# EAGLE design duck_sensor (EAGLE 8.1.1)
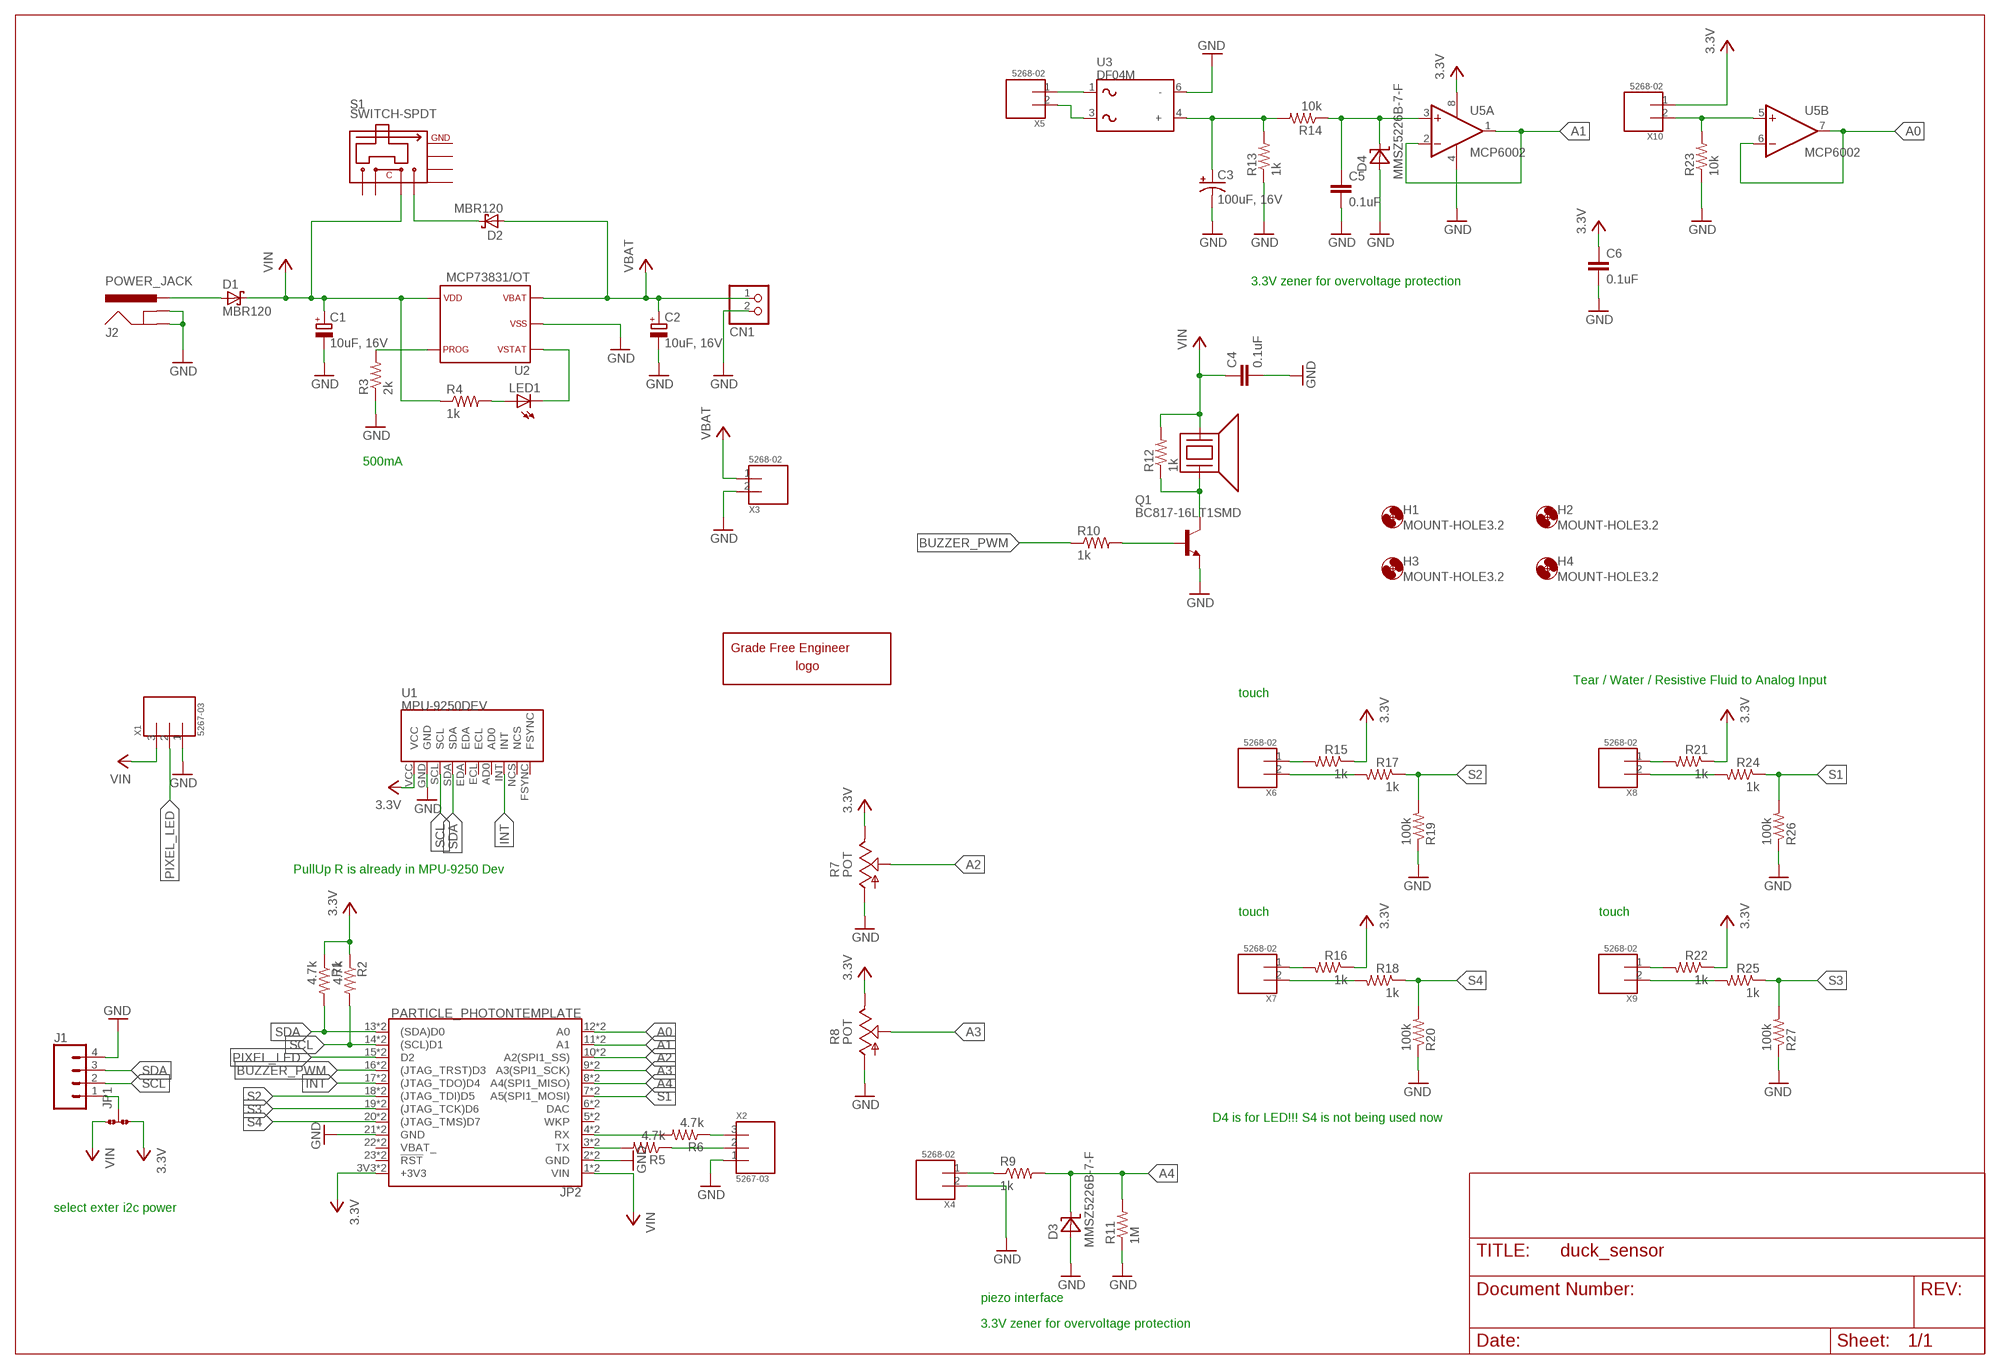
[diagram p0: schematic, sheet 1]

## Parts
C1  10uF, 16V  C-TANTAL-A  [C1206(3216)-A]
C2  10uF, 16V  C-TANTAL-A  [C1206(3216)-A]
C3  100uF, 16V  CPOL-USE2,5-6E  [E2,5-6E]
C4  0.1uF  C0603(1608)_HAND  [C0603(1608)_HANDSOLDER]
C5  0.1uF  C0603(1608)_HAND  [C0603(1608)_HANDSOLDER]
C6  0.1uF  C0603(1608)_HAND  [C0603(1608)_HANDSOLDER]
CN1  JST_2PIN-SMT-RA  [JST-PH-2-SMT-RA]
D1  MBR120  [SOD-123]
D2  MBR120  [SOD-123]
D3  MMSZ5226B-7-F  [SOD-123]
D4  MMSZ5226B-7-F  [SOD-123]
H1  MOUNT-HOLE3.2  [3,2]
H2  MOUNT-HOLE3.2  [3,2]
H3  MOUNT-HOLE3.2  [3,2]
H4  MOUNT-HOLE3.2  [3,2]
J1  CONN_04  [1X04]
J2  POWER_JACK  [POWER_JACK_PTH]
JP1  JP2  [JP2SMD0603]
JP2  PARTICLE_PHOTONTEMPLATE  [PARTICLE_PHOTON_TEMPLATE]
LED1  LED0603  [LED-0603]
LOGO1  GRADEFREELOGO-20  [GRADEFREELOGO-20]
Q1  BC817-16LT1SMD  [SOT23-BEC]
R1  4.7k  R0603(1608)_HAND  [R0603(1608)_HANDSOLDER]
R2  4.7k  R0603(1608)_HAND  [R0603(1608)_HANDSOLDER]
R3  2k  R0603(1608)_HAND  [R0603(1608)_HANDSOLDER]
R4  1k  R0603(1608)_HAND  [R0603(1608)_HANDSOLDER]
R5  4.7k  R0603(1608)_HAND  [R0603(1608)_HANDSOLDER]
R6  4.7k  R0603(1608)_HAND  [R0603(1608)_HANDSOLDER]
R7  POT  [RK09L]
R8  POT  [RK09L]
R9  1k  R0603(1608)_HAND  [R0603(1608)_HANDSOLDER]
R10  1k  R0603(1608)_HAND  [R0603(1608)_HANDSOLDER]
R11  1M  R0603(1608)_HAND  [R0603(1608)_HANDSOLDER]
R12  1k  R0603(1608)_HAND  [R0603(1608)_HANDSOLDER]
R13  1k  R0603(1608)_HAND  [R0603(1608)_HANDSOLDER]
R14  10k  R0603(1608)_HAND  [R0603(1608)_HANDSOLDER]
R15  1k  R0603(1608)_HAND  [R0603(1608)_HANDSOLDER]
R16  1k  R0603(1608)_HAND  [R0603(1608)_HANDSOLDER]
R17  1k  R0603(1608)_HAND  [R0603(1608)_HANDSOLDER]
R18  1k  R0603(1608)_HAND  [R0603(1608)_HANDSOLDER]
R19  100k  R0603(1608)_HAND  [R0603(1608)_HANDSOLDER]
R20  100k  R0603(1608)_HAND  [R0603(1608)_HANDSOLDER]
R21  1k  R0603(1608)_HAND  [R0603(1608)_HANDSOLDER]
R22  1k  R0603(1608)_HAND  [R0603(1608)_HANDSOLDER]
R23  10k  R0603(1608)_HAND  [R0603(1608)_HANDSOLDER]
R24  1k  R0603(1608)_HAND  [R0603(1608)_HANDSOLDER]
R25  1k  R0603(1608)_HAND  [R0603(1608)_HANDSOLDER]
R26  100k  R0603(1608)_HAND  [R0603(1608)_HANDSOLDER]
R27  100k  R0603(1608)_HAND  [R0603(1608)_HANDSOLDER]
S1  SWITCH-SPDT  [SSSS810201]
U1  MPU-9250DEV  [MPU-9250]
U2  MCP73831/OT  [SOT23-5L]
U3  DF04M  [DIL06]
U4  BUZZER  [PS1240]
U5  MCP6002  [DIL08]
X1  5267-03  [5267-03]
X2  5267-03  [5267-03]
X3  5268-02  [5628-02]
X4  5268-02  [5628-02]
X5  5268-02  [5628-02]
X6  5268-02  [5628-02]
X7  5268-02  [5628-02]
X8  5268-02  [5628-02]
X9  5268-02  [5628-02]
X10  5268-02  [5628-02]

## Nets
3.3V: C6.1 JP1.3 JP2.3V3(+3V3) JP2.24(+3V3) R1.1 R2.1 R7.1(E) R8.1(E) R15.1 R16.1 R21.1 R22.1 U1.VCC U5.8(V+) X10.1
A0: JP2.12(A0) JP2.A0 U5.6(B:-IN) U5.7(B:OUT)
A1: JP2.11(A1) JP2.A1 U5.1(A:OUT) U5.2(A:-IN)
A2: JP2.10(A2(SPI1_SS)) JP2.A2(A2(SPI1_SS)) R7.2(S)
A3: JP2.9(A3(SPI1_SCK)) JP2.A3(A3(SPI1_SCK)) R8.2(S)
A4: D3.C JP2.8(A4(SPI1_MISO)) JP2.A4(A4(SPI1_MISO)) R9.2 R11.2
BUZZER_PWM: JP2.16((JTAG_TRST)D3) JP2.D3((JTAG_TRST)D3) R10.1
GND: C1.2(-) C2.2(-) C3.- C4.2 C5.2 C6.2 CN1.2 D3.A D4.A J1.4 J2.GND J2.GNDBREAK JP2.2(GND) JP2.21(GND) JP2.GND@0(GND) JP2.GND@2(GND) Q1.E R3.1 R7.3(A) R8.3(A) R11.1 R13.1 R19.1 R20.1 R23.1 R26.1 R27.1 U1.GND U2.2(VSS) U3.6(-) U5.4(V-) X1.1 X2.1 X3.2 X4.2
INT: JP2.17((JTAG_TDO)D4) JP2.D4((JTAG_TDO)D4) U1.INT
N$1: D2.C S1.1
N$2: R15.2 X6.1
N$3: LED1.A R4.2
N$4: LED1.C U2.1(STAT)
N$5: R3.2 U2.5(PROG)
N$6: D1.A J2.PWR
N$7: R9.1 X4.1
N$8: R17.2 X6.2
N$10: R16.2 X7.1
N$11: R18.2 X7.2
N$12: JP2.3(TX) JP2.TX R5.2
N$13: JP2.4(RX) JP2.RX R6.2
N$14: R6.1 X2.3
N$15: R5.1 X2.2
N$17: Q1.B R10.2
N$18: Q1.C R12.1 U4.2
N$20: J1.1 JP1.2
N$23: C5.1 D4.C R14.1 U5.3(A:+IN)
N$24: R23.2 U5.5(B:+IN) X10.2
N$25: R21.2 X8.1
N$26: R24.2 X8.2
N$27: R22.2 X9.1
N$28: C3.+ R13.2 R14.2 U3.4(+)
N$29: U3.1 X5.1
N$30: U3.3 X5.2
N$31: R25.2 X9.2
PIXEL_LED: JP2.15(D2) JP2.D2 X1.2
S1: JP2.7(A5(SPI1_MOSI)) JP2.A5(A5(SPI1_MOSI)) R24.1 R26.2
S2: JP2.18((JTAG_TDI)D5) JP2.D5((JTAG_TDI)D5) R17.1 R19.2
S3: JP2.19((JTAG_TCK)D6) JP2.D6((JTAG_TCK)D6) R25.1 R27.2
S4: JP2.20((JTAG_TMS)D7) JP2.D7((JTAG_TMS)D7) R18.1 R20.2
SCL: J1.2 JP2.14((SCL)D1) JP2.D1((SCL)D1) R2.2 U1.SCL
SDA: J1.3 JP2.13((SDA)D0) JP2.D0((SDA)D0) R1.2 U1.SDA
VBAT: C2.1(+) CN1.1 D2.A U2.3(VBAT) X3.1
VIN: C1.1(+) C4.1 D1.C JP1.1 JP2.1(VIN) JP2.VIN R4.1 R12.2 S1.2 U2.4(VDD) U4.1 X1.3
Unconnected: JP2.5(WKP) JP2.6(DAC) JP2.23(!RST!) JP2.DAC JP2.RST(!RST!) JP2.WKP S1.3 S1.4 S1.G1(GNDTERMINAL) S1.G2(GNDTERMINAL1) S1.G3(GNDTERMINAL2) S1.G4(GNDTERMINAL3) U1.AD0 U1.ECL U1.EDA U1.FSYNC U1.NCS

## Notes on the sheet
- 3.3V zener for overvoltage protection
- 500mA
- Tear / Water / Resistive Fluid to Analog Input
- touch
- PullUp R is already in MPU-9250 Dev
- touch | touch
- D4 is for LED!!! S4 is not being used now
- select exter i2c power
- piezo interface
- 3.3V zener for overvoltage protection

## Power pins joined to a net without a drawn wire
VBAT_: JP2.22(VBAT_) JP2.VBAT_

## Library data of the parts
C1 C2 = berry:C-TANTAL-A: TAJA105M020RNJ Tantal Capacitor Manufacturer: AVX 1206(3126) Ref: www.avx.com/docs/techinfo/tantappl.pdf
C3 = adafruit:CPOL-US: POLARIZED CAPACITOR, American symbol
C4-C6 = GFE:C
CN1 = GFE:JST_2PIN: JST 2-Pin Connectors of various flavors SMT-RA (S2B-PH-SM4) 4UConnector #17311 SMT (B2B-PH-SM4) THM-RA (S2B-PH) THM (B2B-PH)
D1 D2 = GFE:MBR120
D3 D4 = GFE:MMSZ5226B-7-F
H1-H4 = holes:MOUNT-HOLE: MOUNTING HOLE with drill center marker
J1 = SparkFun-Connectors:CONN_04: Multi connection point. Often used as Generic Header-pin footprint for 0.1 inch spaced/style header connections On any of the 0.1 inch spaced packages, you can populate with these: Break Away Headers - Straight <https://www.sparkfun.com/products/116> (PRT-00116) Break Away Male Headers - Right Angle <https://www.sparkfun.com/products/553> (PRT-00553) Female Headers <https://www.sparkfun.com/products/115> (PRT-00115) Break Away Headers - Machine Pin <https://www.sparkfun.com/products/117> (PRT-00117) Break Away Female Headers - Swiss Machine Pin <https://www.sparkfun.com/products/743> (PRT-00743) For SCREWTERMINALS and SPRING TERMINALS visit here: Screw Terimnals on SparkFun.com <https://www.sparkfun.com/search/results?term=Screw+Terminals> (5mm/3.5mm/2.54mm spacing) This device is also useful as a general connection point to wire up your design to another part of your project. Our various solder wires solder well into these plated through hole pads. Hook-Up Wire - Assortment (Stranded, 22 AWG) <https://www.sparkfun.com/products/11375> (PRT-11375) Hook-Up Wire - Assortment (Solid Core, 22 AWG) <https://www.sparkfun.com/products/11367> (PRT-11367) View the entire wire category on our website here <https://www.sparkfun.com/categories/141> Special notes: Molex polarized connector foot print use with SKU : PRT-08231 with associated crimp pins and housings. 1MM SMD Version SKU: PRT-10208; PROD_ID: CONN-09696
J2 = GFE:POWER_JACK: Power Jack Connector This is the standard 5.5mm barrel jack for power. The PTH is the most common, proven, reliable, footprint. The Slot footprint only works if the mill layer is transmitted to the PCB fab house so be warned. Here are the connectors we sell at SparkFun: DC Barrel Power Jack/Connector <https://www.sparkfun.com/products/119> (PRT-00119) DC Barrel Power Jack/Connector (SMD) <https://www.sparkfun.com/products/12748> (PRT-12748) DC Barrel Jack Adapter - Breadboard Compatible <https://www.sparkfun.com/products/10811> (PRT-10811) It is used on this SparkFun product (and many, many others): SparkFun RedBoard - Programmed with Arduino <https://www.sparkfun.com/products/12757> (DEV-12757) Also, if you need a mating power supply or connector, please check these out: Wall Adapter Power Supply - 9VDC 650mA <https://www.sparkfun.com/products/298> (TOL-00298) DC Barrel Jack Adapter - Male <https://www.sparkfun.com/products/10287> (PRT-10287); PROD_ID: CONN-08197
JP1 = OSSI:JP2
JP2 = GFE:PARTICLE_PHOTON: Particle Photon Footprint of the Particle Photon that is used as a basis for many Photon shields. SparkFun Products: Particle Photon <https://www.sparkfun.com/products/13764> SparkFun Photon ProtoShield <https://www.sparkfun.com/products/13598> SparkFun Photon micro OLED Shield <https://www.sparkfun.com/products/13628> SparkFun Photon IMU Shield <https://www.sparkfun.com/products/13629> SparkFun Photon Battery Shield <https://www.sparkfun.com/products/13626>
LED1 = GFE:LED: LEDs Standard schematic elements and footprints for 5mm, 3mm, 1206, and 0603 sized LEDs. 5mm - Spark Fun Electronics SKU : COM-00529 (and others)
LOGO1 = GFE:GRADEFREELOGO
Q1 = GFE:BC817*: NPN Transistor
R1-R6 R9-R27 = GFE:R
R7 R8 = synth:POT
S1 = GFE:SWITCH-SPDT
U1 = GFE:MPU-9250DEV
U2 = GFE:MCP73831: MCP73831/2 Miniature Single-Cell, Fully Integrated Li-Ion, Li-Polymer Charge Management Controllers. Nice and small simple lipoly charge controller, with adjustable current and status output (LED) http://www.ladyada.net/library/pcb/eaglelibrary.html
U3 = GFE:DF04M
U4 = GFE:BUZZER
U5 = synth:MCP6002
X1 X2 = GFE:5267-03
X3-X10 = GFE:5268-02

## Board
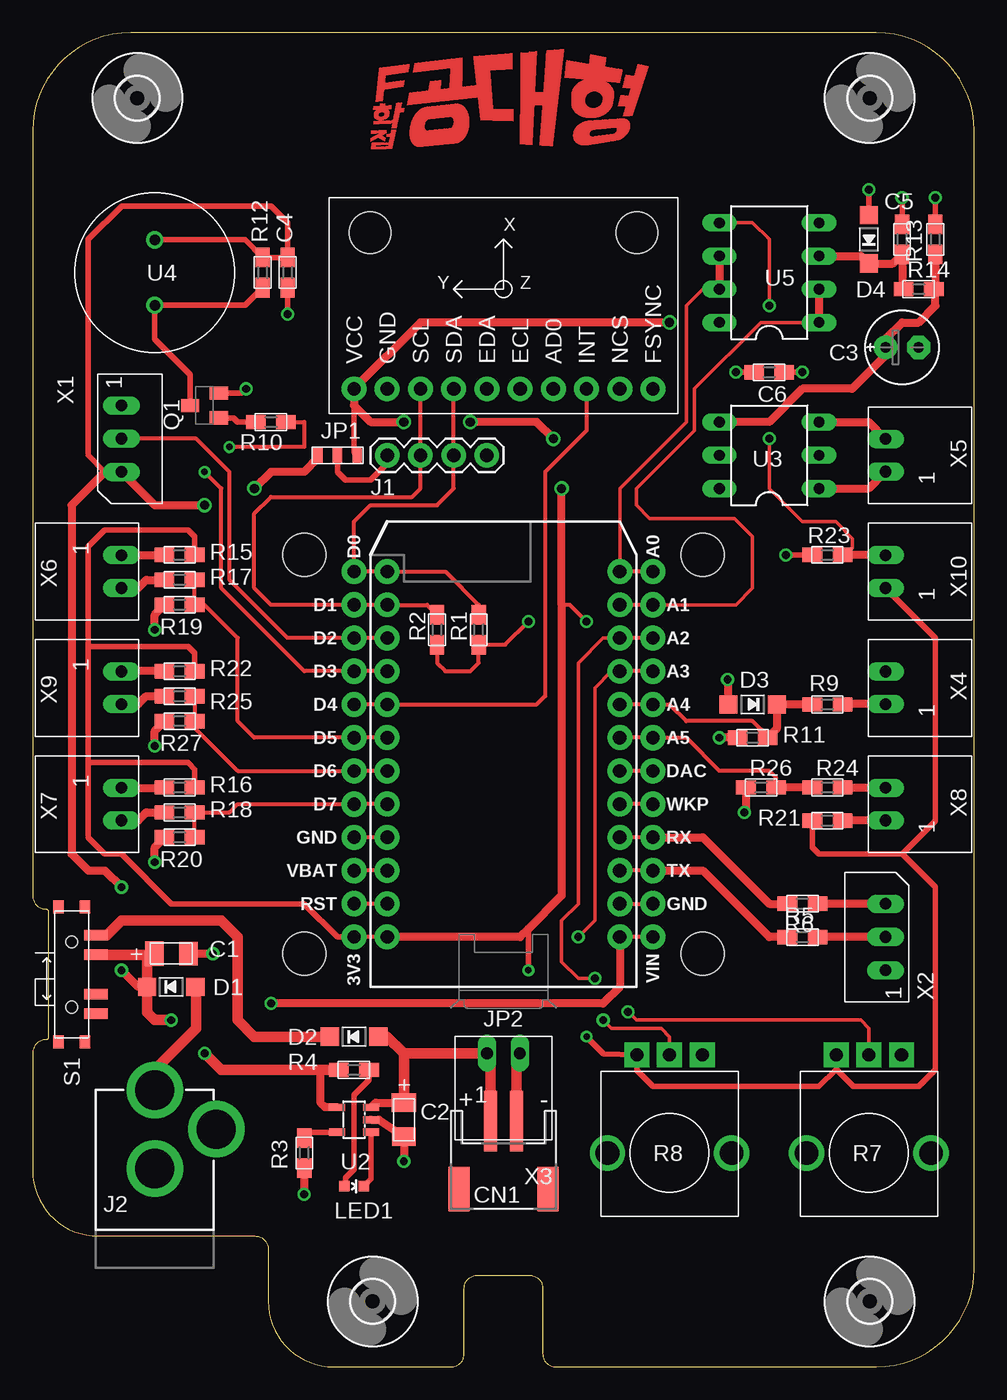
[diagram p1: board, top side]
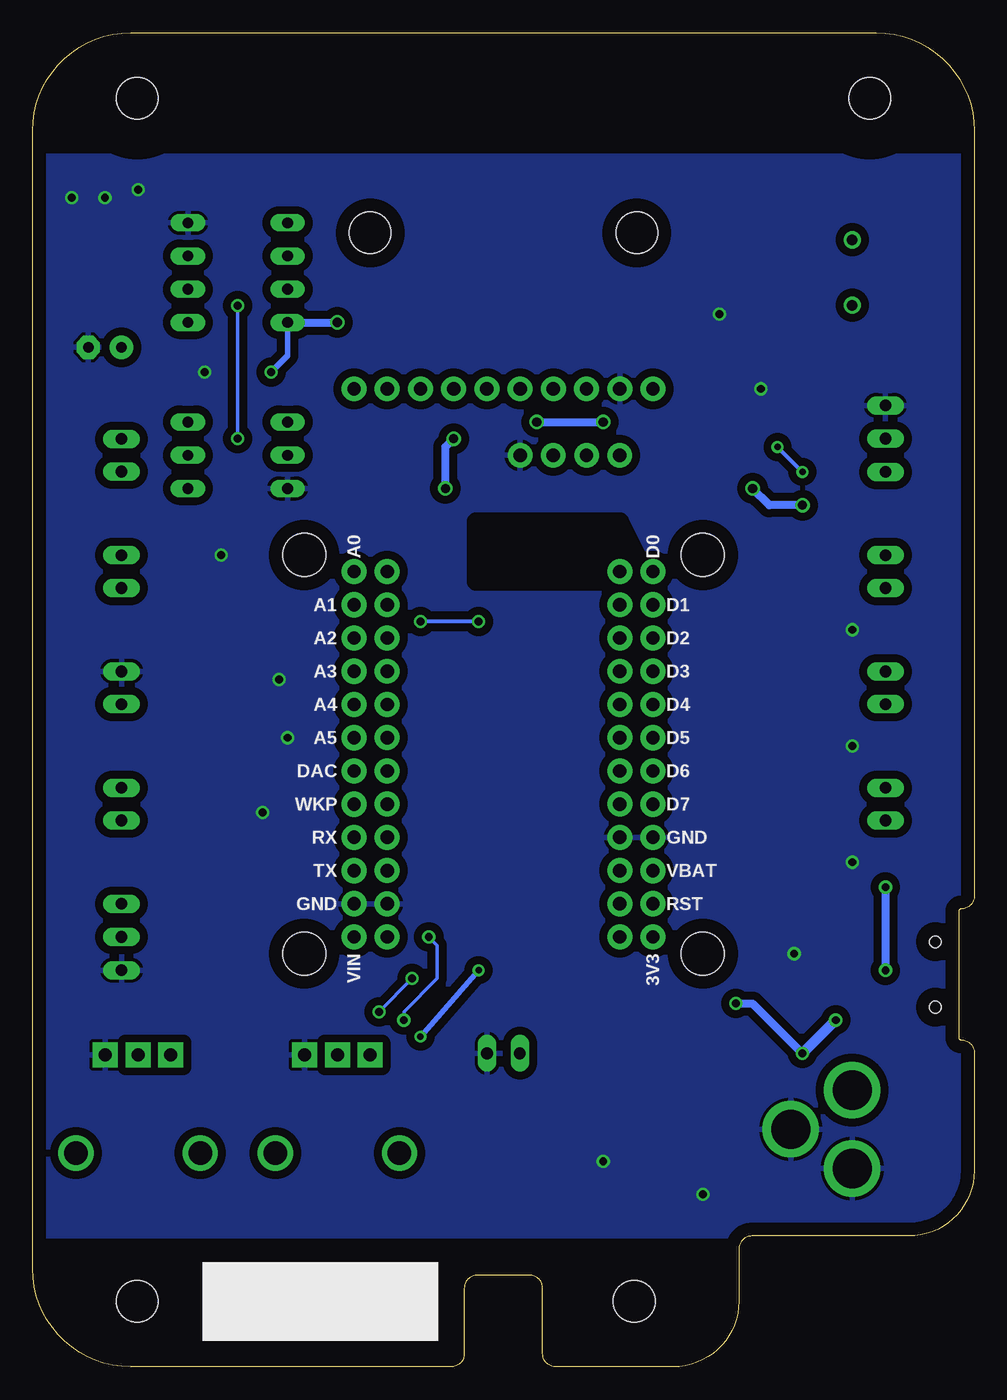
[diagram p2: board, bottom side, seen from below]

Size 72 x 102 mm. Coordinates in mm from the lower left corner, seen from the top.
Outline: 0,24 0,15 arc90 5,10 17,10 arc-90 18,9 18,5 arc90 23,0 32,0 arc90 33,1 33,6 arc-90 34,7 38,7 arc-90 39,6 39,1 arc90 40,0 64.5,0 arc90 72,7.5 72,94.5 arc90 64.5,102 7.5,102 arc90 0,94.5 0,36 arc90 1,35 arc-90 1.2,34.8 1.2,25.2 arc-90 1,25 arc90 0,24
Copper layers (1*16): Top 0.035mm / dielectric 1.5mm / Bottom 0.035mm
Design rules "default": minimum track width 10mil, minimum drill 24mil, track to track 8mil, track to pad 8mil, pad to pad 8mil, via to via 8mil, smd to smd 8mil, copper to edge 40mil, drill to drill 8mil, minimum pad ring 10mil, minimum via ring 8mil, stop-mask expansion 4mil, vias tented up to drill 0mil, thermal gap 10mil

### Footprints (pad centres in the part's own frame; a part is rotated, then mirrored left to right if it is on the bottom)
C1206(3216)-A = smd 1.4 x 1.9: 1 -1.3,0 | smd 1.4 x 1.8: 2 1.3,0
E2,5-6E = drill 0.813 pad 1.778: + -1.27,0 | drill 0.813 pad 1.778 octagon: - 1.27,0
C0603(1608)_HANDSOLDER = smd 1.5 x 1.1: 1 -1.15,0; 2 1.15,0
JST-PH-2-SMT-RA = smd 1 x 4.6: 1 1,-3.7; 2 -1,-3.7 | smd 1.6 x 3.4: NC1 -3.4,1.5; NC2 3.4,1.5
SOD-123 = smd 1.4 x 1.4: A 1.85,0; C -1.85,0
3,2 = hole 3.2: 0,0
1X04 = drill 1.016 pad 1.88: 1 0,0; 2 2.54,0; 3 5.08,0; 4 7.62,0
POWER_JACK_PTH = drill 2.997 pad 4.318: GND 0,7.7; GNDBREAK 4.7,10.7; PWR 0,13.7
JP2SMD0603 = smd 0.7 x 1.1: 1 -1.5,0; 2 0,0; 3 1.5,0
PARTICLE_PHOTON_TEMPLATE = drill 1.016 pad 1.905: 1 -8.89,13.97; 2 -8.89,11.43; 3 -8.89,8.89; 4 -8.89,6.35; 5 -8.89,3.81; 6 -8.89,1.27; 7 -8.89,-1.27; 8 -8.89,-3.81; 9 -8.89,-6.35; 10 -8.89,-8.89; 11 -8.89,-11.43; 12 -8.89,-13.97; 13 8.89,-13.97; 14 8.89,-11.43; 15 8.89,-8.89; 16 8.89,-6.35; 17 8.89,-3.81; 18 8.89,-1.27; 19 8.89,1.27; 20 8.89,3.81; 21 8.89,6.35; 22 8.89,8.89; 23 8.89,11.43; 24 8.89,13.97 | drill 1.016 pad 1.93: 3V3 11.43,13.97; A0 -11.43,-13.97; A1 -11.43,-11.43; A2 -11.43,-8.89; A3 -11.43,-6.35; A4 -11.43,-3.81; A5 -11.43,-1.27; D0 11.43,-13.97; D1 11.43,-11.43; D2 11.43,-8.89; D3 11.43,-6.35; D4 11.43,-3.81; D5 11.43,-1.27; D6 11.43,1.27; D7 11.43,3.81; DAC -11.43,1.27; GND@0 -11.43,11.43; GND@2 11.43,6.35; RST 11.43,11.43; RX -11.43,6.35; TX -11.43,8.89; VBAT_ 11.43,8.89; VIN -11.43,13.97; WKP -11.43,3.81 | hole 3.302: -15.24,15.24; 15.24,15.24; -15.24,-15.24; 15.24,-15.24
LED-0603 = smd 0.8 x 0.8: A 0,-0.75; C 0,0.75
SOT23-BEC = smd 1 x 1.4: B -0.95,-1.1; C 0,1.1; E 0.95,-1.1
R0603(1608)_HANDSOLDER = smd 1.5 x 1.1: 1 -1.15,0; 2 1.15,0
RK09L = drill 1 pad 1.905 square: 1 2.5,-7.5; 2 0,-7.5; 3 -2.5,-7.5 | drill 1.8: P$4 -4.75,0; P$5 4.75,0
SSSS810201 = smd 0.8 x 1.8: 1 -3,1.85; 2 -1.5,1.85; 3 1.5,1.85; 4 3,1.85 | smd 1 x 0.8: G1 -5.15,1; G2 -5.15,-1; G3 5.15,-1; G4 5.15,1 | hole 0.9: -2.5,0; 2.5,0
MPU-9250 = drill 1.016 pad 1.905: AD0 3.81,1.27; ECL 1.27,1.27; EDA -1.27,1.27; FSYNC 11.43,1.27; GND -8.89,1.27; INT 6.35,1.27; NCS 8.89,1.27; SCL -6.35,1.27; SDA -3.81,1.27; VCC -11.43,1.27 | hole 3.2: 10.2,13.2; -10.2,13.2
SOT23-5L = smd 0.55 x 1.2: 1 -0.95,-1.3; 2 0,-1.3; 3 0.95,-1.3; 4 0.95,1.3; 5 -0.95,1.3
DIL06 = drill 0.813 long: 1 -2.54,-3.81; 2 0,-3.81; 3 2.54,-3.81; 4 2.54,3.81; 5 0,3.81; 6 -2.54,3.81
PS1240 = drill 0.8: 1 -2.5,0; 2 2.5,0
DIL08 = drill 0.813 long: 1 -3.81,-3.81; 2 -1.27,-3.81; 3 1.27,-3.81; 4 3.81,-3.81; 5 3.81,3.81; 6 1.27,3.81; 7 -1.27,3.81; 8 -3.81,3.81
5267-03 = drill 0.9 long: 1 2.54,0; 2 0,0; 3 -2.54,0
5628-02 = drill 0.9 long: 1 1.25,0; 2 -1.25,0

### Placement (x,y rotation side)
C1  10.6,31.59 0 top
C2  28.38,18.89 270 top
C3  66.48,77.94 0 top
C4  19.49,83.66 270 top
C5  66.48,86.2 90 top
C6  56.32,76.04 0 top
CN1  36,15.08 180 top
D1  10.6,29.05 0 top
D2  24.57,25.24 0 top
D3  55.05,50.64 180 top
D4  63.94,86.2 90 top
H1  26,5 0 top
H2  64,5 0 top
H3  8,97 0 top
H4  64,97 0 top
J1  27.11,69.69 0 top
J2  9.33,7.46 0 top
JP1  23.3,69.69 0 top
JP2  36,46.83 180 top
LED1  24.57,13.81 270 top
LOGO1  25.84,93.09 0 top
Q1  13.14,73.5 90 top
R1  34.09,56.35 90 top
R2  30.92,56.35 90 top
R3  20.76,16.35 90 top
R4  24.57,22.7 0 top
R5  58.86,32.86 180 top
R6  58.86,35.4 180 top
R7  63.94,16.35 180 top
R8  48.7,16.35 180 top
R9  60.77,50.64 180 top
R10  18.22,72.23 180 top
R11  55.05,48.1 0 top
R12  17.59,83.66 90 top
R13  69.02,86.2 270 top
R14  67.75,82.39 0 top
R15  11.23,62.07 180 top
R16  11.23,44.29 180 top
R17  11.23,60.16 180 top
R18  11.23,42.38 180 top
R19  11.23,58.26 0 top
R20  11.23,40.48 0 top
R21  60.77,41.75 0 top
R22  11.23,53.18 180 top
R23  60.77,62.07 0 top
R24  60.77,44.29 0 top
R25  11.23,51.27 180 top
R26  55.69,44.29 0 top
R27  11.23,49.37 0 top
S1  2.98,30 270 top
U1  36,73.5 0 top
U2  24.57,18.89 90 top
U3  56.32,69.69 90 top
U4  9.33,83.66 270 top
U5  56.32,83.66 90 top
X1  6.79,70.96 90 top
X2  65.21,32.86 270 top
X3  36,23.97 180 top
X4  65.21,51.91 270 top
X5  65.21,69.69 270 top
X6  6.79,60.8 90 top
X7  6.79,43.02 90 top
X8  65.21,43.02 270 top
X9  6.79,51.91 90 top
X10  65.21,60.8 270 top

### Tracks (layer width: path | path; a pad name or v marks a point on that pad's centre or on a via)
3.3V  (via drill 0.5, 0.6, 0.7)
  Top 0.305: R2.1 30.92,53.81 31.55,53.18 33.46,53.18 34.09,53.81 R1.1 36.12,55.2 v37.91,56.99 | v42.35,56.99 41.08,58.26 40.45,58.26
  Top 0.406: 61.44,22.74 R7.1 | 61.44,22.74 60.13,21.43 47.43,21.43 46.2,22.66 R8.1 43.66,23.93 v42.35,25.24 | v37.91,30.32 37.91,33.5 | R21.1 59.61,39.73 60.13,39.21 66.48,39.21 | 66.48,39.21 69.02,36.67 69.02,22.7 67.75,21.43 62.75,21.43 61.44,22.74 | X10.1 65.21,59.53 69.02,55.72 69.02,41.75 66.48,39.21 | JP2.3V3 23.3,32.86 20.76,35.4 10.6,35.4 6.79,39.21 5.52,39.21 4.25,40.48 4.25,46.2 | 4.25,46.2 4.25,55.09 | 4.25,55.09 4.25,62.7 5.52,63.98 11.87,63.98 12.39,63.46 R15.1 | R22.1 12.39,54.57 11.87,55.09 4.25,55.09 | R16.1 12.39,45.68 11.87,46.2 4.25,46.2 | U1.VCC 24.57,69.92 JP1.3 | C6.1 v53.78,76.04
  Top 0.61: JP2.24 37.27,32.86 37.91,33.5 40.45,36.03 40.45,58.26 v40.45,67.15 | v39.81,70.96 38.54,72.23 v33.46,72.23 | v28.38,72.23 25.84,72.23 24.57,73.5 U1.VCC 29.65,79.85 v48.7,79.85
  Bottom 0.305: v37.91,56.99 v42.35,56.99
  Bottom 0.406: v42.35,25.24 v37.91,30.32 | v53.78,76.04 52.51,77.31 U5.8
  Bottom 0.61: v40.45,67.15 40.45,70.33 v39.81,70.96 | v33.46,72.23 v28.38,72.23 | U5.8 v48.7,79.85
A0
  Top 0.254: U5.7 51.24,82.39 49.97,81.12 49.97,72.23 44.89,67.15 JP2.12
  Top 0.61: U5.6 U5.7
A1
  Top 0.254: U5.1 55.69,79.85 50.61,74.77 50.61,71.59 46.16,67.15 46.16,65.88 47.18,64.86 53.67,64.86 55.05,63.48 55.05,59.53 53.78,58.26 JP2.A1
  Top 0.61: U5.2 U5.1
A2  (via drill 0.6)
  Top 0.254: R7.2 63.94,25.88 63.3,26.51 46.16,26.51 v45.52,27.14 | 44.26,55.72 JP2.10 43.62,55.72 41.72,53.81 41.72,35.4 40.45,34.13 40.45,30.95 41.72,29.68 v42.98,29.68
  Bottom 0.254: v45.52,27.14 v42.98,29.68
A3  (via drill 0.6)
  Top 0.254: R8.2 48.7,25.24 48.06,25.88 44.26,25.88 v43.62,26.51 | JP2.9 44.26,53.18 42.98,51.91 42.98,34.13 v41.72,32.86
  Bottom 0.254: v43.62,26.51 43.62,27.14 41.08,29.68 41.08,32.23 v41.72,32.86
A4
  Top 0.305: JP2.A4 48.7,50.64 49.97,49.37 55.05,49.37 56.2,48.22 R11.2
  Top 0.61: R9.2 D3.C 56.9,48.8 R11.2
BUZZER_PWM  (via drill 0.5)
  Top 0.305: JP2.D3 20.76,53.18 14.41,59.53 14.41,67.15 v13.14,68.42 | R10.1 20.76,72.23 20.76,70.33 v15.05,70.33
  Bottom 0.305: v15.05,70.33 v13.14,68.42
GND  (via drill 0.6 pad 0.61)
  Top 0.406: Q1.E 16,74.45 v16.32,74.77 | C4.2 v19.49,80.48 | D4.A v63.94,90.01 | C5.2 v66.48,89.38 | R13.1 v69.02,89.38 | v58.86,76.04 C6.2 | v57.59,62.07 R23.1
  Top 0.61: R3.1 v20.76,13.18 | v28.38,15.71 C2.2 28.38,17.62 26.48,18.89 U2.2 | v9.33,47.47 9.33,48.62 R27.1 | v9.33,38.58 9.33,39.73 R20.1 | v9.33,56.35 9.33,57.51 R19.1 | D3.A 53.2,52.49 v53.14,52.55 | R26.1 54.53,42.51 v54.41,42.38 | C1.2 v13.77,31.59 | R11.1 v52.51,48.1
  Top 0.813: CN1.2 37,23.72 X3.2
  pour Bottom (isolate 0.61): 0.44,92.55 -0.83,92.55 -0.83,10 71.56,10 71.56,92.55
INT
  Top 0.305: U1.INT 42.35,71.59 39.17,68.42 39.17,51.27 38.54,50.64 JP2.17
N$1
  Top 0.813: D2.C 16.95,25.24 15.68,26.51 15.68,32.86 14.41,34.13 6.79,34.13 5.66,33 S1.1
N$2
  Top 0.61: X6.1 10.07,62.05 R15.2
N$3
  Top 0.406: R4.2 25.72,21.95 24.57,20.8 24.57,15.08 23.94,14.45 23.94,13.93 LED1.A
N$4
  Top 0.406: U2.1 25.87,14.36 LED1.C
N$5
  Top 0.406: U2.5 21.2,17.94 R3.2
N$6
  Top 0.813: J2.PWR 9.33,22.7 12.5,25.88 12.5,29 D1.A
N$7
  Top 0.61: X4.1 61.94,50.66 R9.1
N$8
  Top 0.61: X6.2 8.08,59.55 8.7,60.16 R17.2
N$10
  Top 0.61: X7.1 10.07,44.27 R16.2
N$11
  Top 0.61: X7.2 8.08,41.77 8.7,42.38 R18.2
N$12
  Top 0.61: R5.2 56.32,32.86 51.24,37.94 JP2.TX
N$13
  Top 0.61: JP2.RX 51.24,40.48 56.32,35.4 R6.2
N$14
  Top 0.61: X2.3 R6.1
N$15
  Top 0.61: X2.2 R5.1
N$17
  Top 0.406: Q1.B 15.36,72.55 15.68,72.23 R10.2
N$18
  Top 0.406: R12.1 16.23,81.16 U4.2 9.33,78.58 12.04,75.87 Q1.C
N$20
  Top 0.406: J1.1 27.11,69.06 25.84,67.78 23.94,67.78 23.3,68.42 JP1.2
N$23
  Top 0.61: R14.1 66.48,82.51 C5.1 65.78,84.35 D4.C 63.36,84.93 U5.3
N$24  (via drill 0.6)
  Top 0.254: U5.5 55.05,87.47 56.32,86.2 v56.32,81.12 | v56.32,70.96 56.32,67.15 58.86,64.61 61.4,64.61 62.67,63.34 62.67,62.59 R23.2
  Top 0.61: X10.2 61.94,62.05 R23.2
  Bottom 0.254: v56.32,81.12 v56.32,70.96
N$25
  Top 0.61: X8.1 61.94,41.77 R21.2
N$26
  Top 0.61: X8.2 61.94,44.27 R24.2
N$27
  Top 0.61: R22.2 6.81,53.18 X9.1
N$28
  Top 0.61: U3.4 56.32,72.23 58.86,74.77 62.67,74.77 65.21,77.31 C3.+ 65.21,78.58 66.48,79.85 67.75,79.85 69.02,81.12 69.02,82.27 R14.2 69.02,82.51 R13.2
N$29
  Top 0.61: U3.1 63.92,67.15 X5.1
N$30
  Top 0.61: U3.3 63.92,72.23 X5.2
N$31
  Top 0.61: X9.2 8.08,50.66 8.7,51.27 R25.2
PIXEL_LED
  Top 0.305: JP2.D2 19.49,55.72 15.05,60.16 15.05,68.42 12.5,70.96 X1.2
S1
  Top 0.305: JP2.A5 49.97,48.1 52.51,45.56 56.32,45.56 56.84,45.05 R26.2
  Top 0.61: R24.1 R26.2
S2
  Top 0.305: R17.1 R19.2 13.14,58.26 15.68,55.72 15.68,49.37 16.95,48.1 JP2.D5
S3
  Top 0.305: R25.1 R27.2 12.39,48.85 15.68,45.56 JP2.D6
S4
  Top 0.305: R20.2 R18.1 15.05,42.38 15.68,43.02 JP2.D7
SCL
  Top 0.305: U1.SCL J1.2 29.65,67.15 29.02,66.52 18.22,66.52 16.95,65.25 16.95,59.53 18.22,58.26 JP2.D1 | JP2.14 30.16,58.26 R2.2
SDA
  Top 0.305: U1.SDA J1.3 32.19,67.15 30.92,65.88 25.84,65.88 24.57,64.61 JP2.D0 | JP2.13 31.55,60.8 34.09,58.26 R1.2
VBAT
  Top 0.61: C2.1 26.22,20.19 U2.3
  Top 0.813: 28.38,23.97 C2.1 | 28.38,23.97 27.11,25.24 D2.A | 28.38,23.97 X3.1 35,23.72 CN1.1
VIN  (via drill 0.6 pad 0.61, 0.6 pad 0.81, 0.7)
  Top 0.406: U4.1 16.23,86.16 R12.2 C4.1 19.49,87.47 18.22,88.74 6.79,88.74 4.25,86.2 4.25,69.69 5.52,68.42
  Top 0.61: U2.4 22.35,19.84 22.03,20.16 22.03,22.7 | JP2.1 44.89,29.05 43.62,27.78 v18.22,27.78 | v6.79,36.67 5.52,37.94 4.25,37.94 2.98,39.21 2.98,65.88 5.52,68.42 X1.3 9.33,65.88 v13.14,65.88 | D1.C 8.06,29.05 v6.79,30.32 | v16.95,67.15 18.22,68.42 20.76,68.42 21.8,69.46 JP1.1
  Top 0.813: C1.1 8.75,31.04 D1.C 8.75,27.09 9.33,26.51 v10.6,26.51 | 9.07,31.82 C1.1 | R4.1 22.03,22.7 14.41,22.7 v13.14,23.97 | S1.2 9.21,31.5 C1.1
  Bottom 0.61: v18.22,27.78 16.95,27.78 v13.14,23.97 | v6.79,36.67 v6.79,30.32 | v13.14,65.88 15.68,65.88 v16.95,67.15
  Bottom 0.813: v13.14,23.97 v10.6,26.51